# EAGLE design CO2SN (EAGLE 9.5.0)
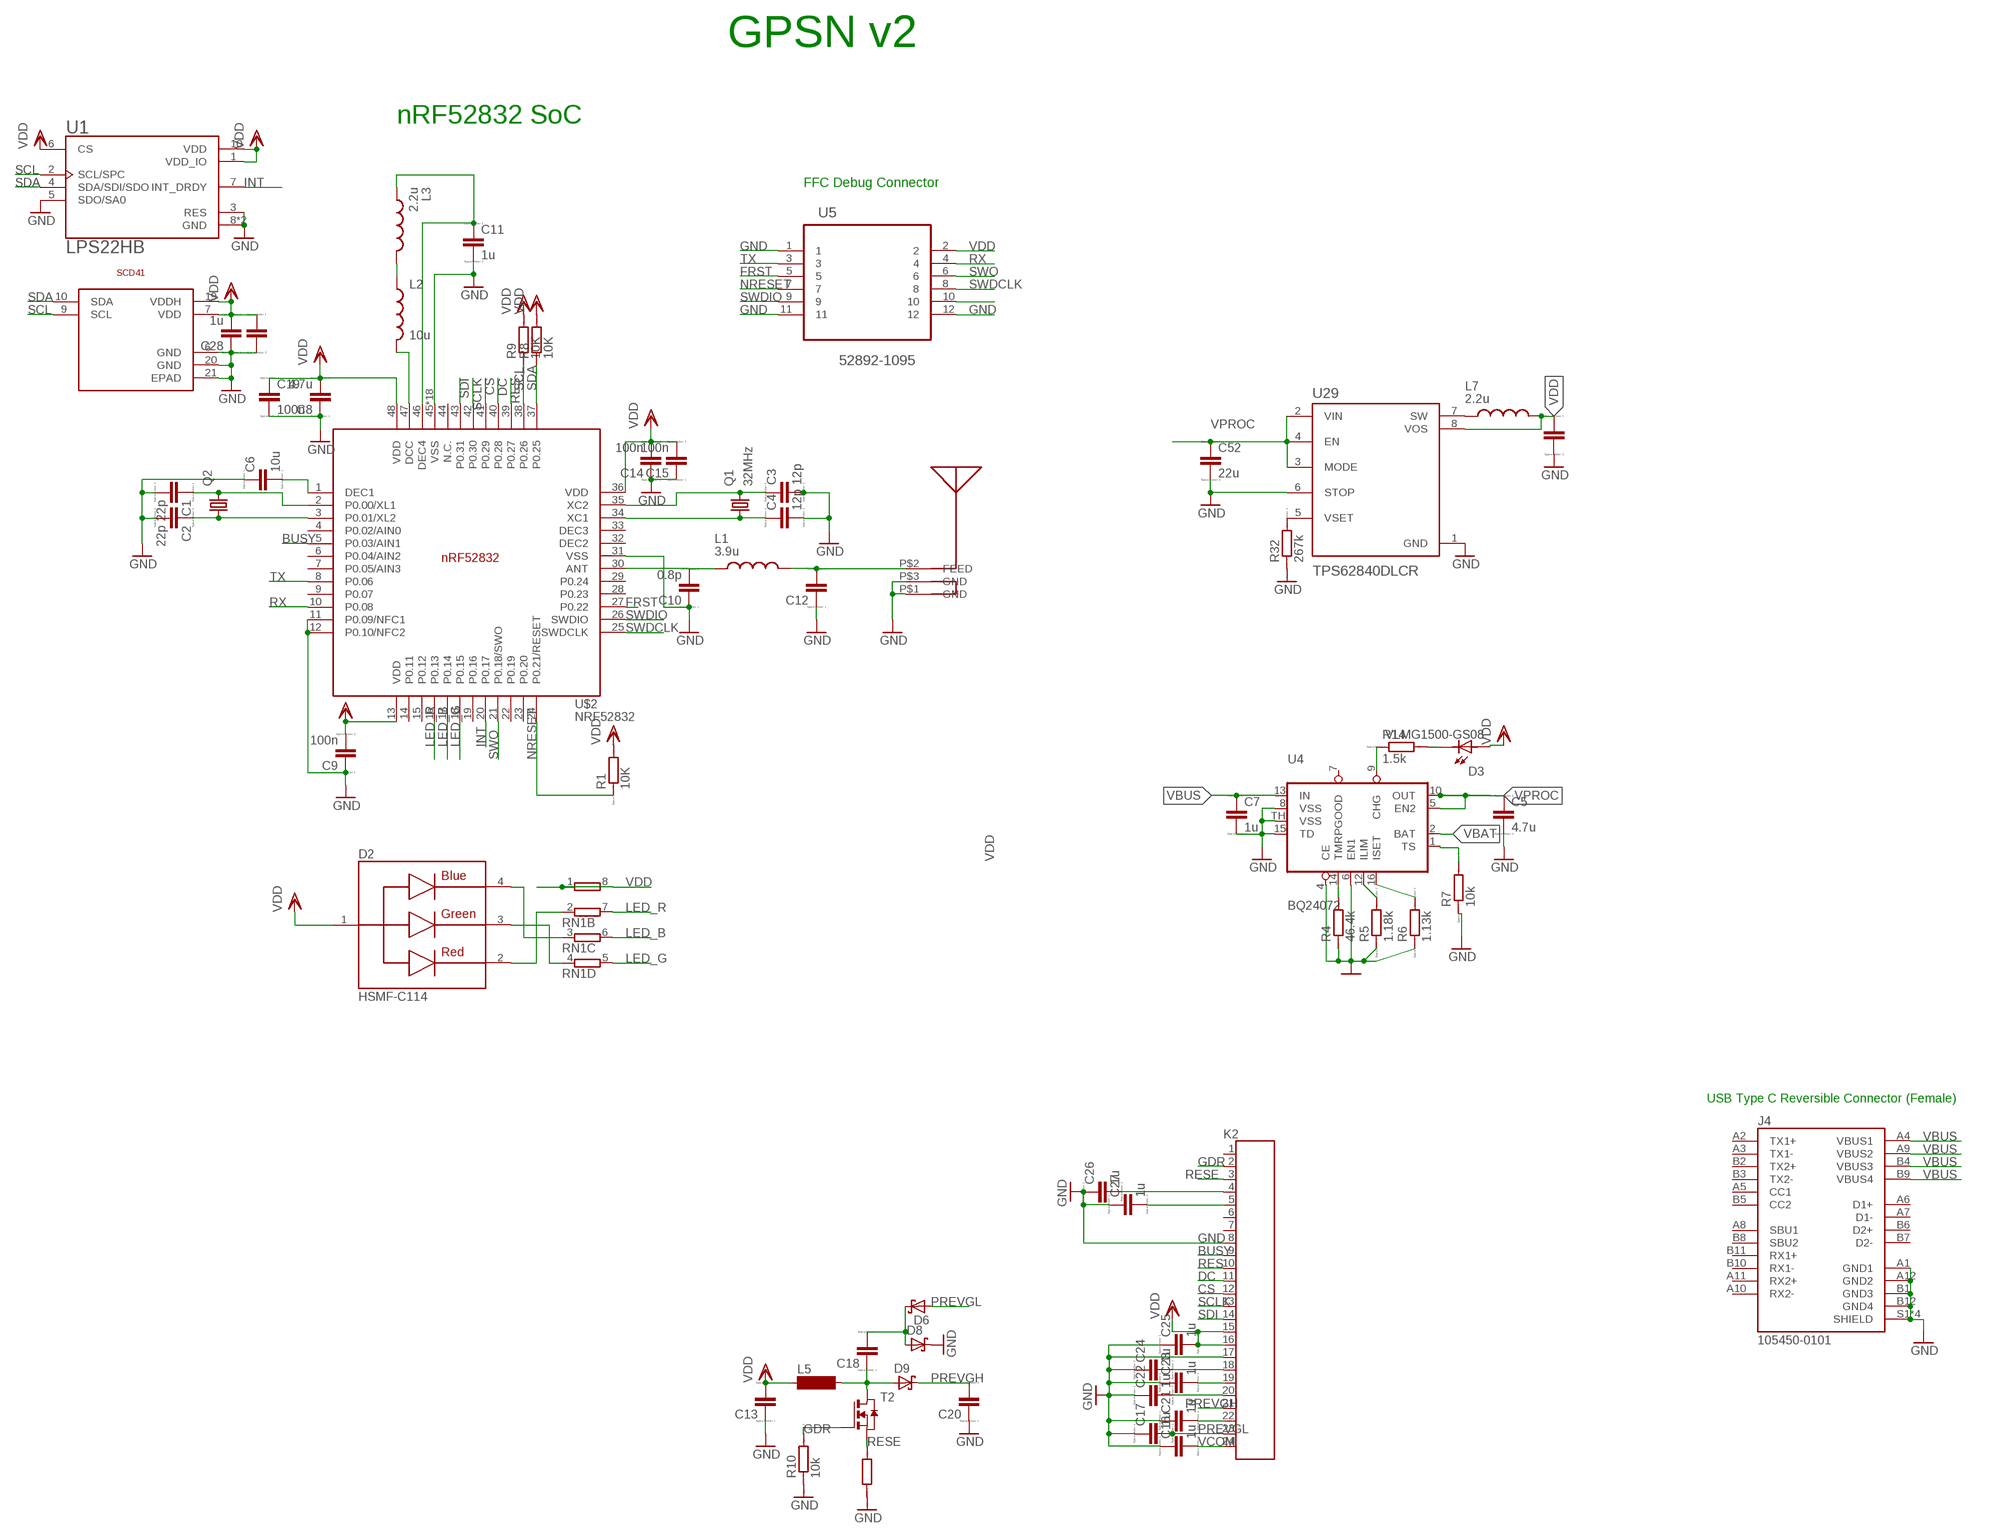
[diagram p0: schematic, sheet 1]

## Parts
C1  22p  CC0402  [C0402]
C2  22p  CC0402  [C0402]
C3  12p  CC0402  [C0402]
C4  12p  CC0402  [C0402]
C5  4.7u  CC0402  [C0402]
C6  10u  CC0402  [C0402]
C7  1u  CC0402  [C0402]
C8  4.7u  CC0402  [C0402]
C9  100n  CC0603R  [C0603R]
C10  0.8p  CC0402  [C0402]
C11  1u  CC0402  [C0402]
C12  1.2p  CC0402  [C0402]
C13  100n  CC0603R  [C0603R]
C14  100n  CC0402  [C0402]
C15  100n  CC0402  [C0402]
C16  1u  CC0402  [C0402]
C17  1u  CC0402  [C0402]
C18  100n  CC0603R  [C0603R]
C19  100n  CC0402  [C0402]
C20  100n  CC0603R  [C0603R]
C21  1u  CC0402  [C0402]
C22  1u  CC0402  [C0402]
C23  1u  CC0402  [C0402]
C24  1u  CC0402  [C0402]
C25  1u  CC0402  [C0402]
C26  1u  CC0402  [C0402]
C27  1u  CC0402  [C0402]
C28  1u  CC0402  [C0402]
C29  22u  CC0603R  [C0603R]
C52  22u  CC0603R  [C0603R]
C58  22u  CC0603R  [C0603R]
D2  HSMF-C114  [DIOSC160X150X35-4N]
D3  VLMG1500-GS08  [LEDC1005X35N]
D6  1PS79SB30,115  [SOD523]
D8  1PS79SB30,115  [SOD523]
D9  1PS79SB30,115  [SOD523]
J4  105450-0101  [MOLEX_105450-0101]
K2  687124149022  [687124149022]
L1  3.9u  MHQ0402P7N5JT000  [INDC0402X26N]
L2  10u  INDUCTOR  [L0603]
L3  2.2u  MHQ0402P7N5JT000  [INDC0402X26N]
L5  SM-NE29  [SM-NE29]
L7  2.2u  1277AS-H-1R5M=P2  [INDC3225X120N]
Q1  32MHz  KX-5  [2.0X1.6_KX-5]
Q2  KX-327-RT  [2.0X1.2]
R1  10K  RR0402  [R0402]
R4  46.4k  RR0402  [R0402]
R5  1.18k  RR0402  [R0402]
R6  1.13k  RR0402  [R0402]
R7  10k  RR0402  [R0402]
R8  10K  RR0402  [R0402]
R9  10K  RR0402  [R0402]
R10  10k  RR0402  [R0402]
R11  0.47  RR0402  [R0402]
R14  1.5k  RR0402  [R0402]
R32  267k  RR0402  [R0402]
RN1  4R-N0402ARV341  [4X0402ARV341]
T2  NMOSSOT23  [SOT-23]
U1  LPS22HB  [LGA10R50P2X3_200X200X80]
U4  BQ24072  [S-PVQFN-N16]
U5  52892-1095  [MOLEX_52892-1095]
U29  TPS62840DLCR  [SON50P200X150X100-8N]
U$1  SCD41  [SCD41]
U$2  NRF52832  [QFN40P600X600X90-48_N]
U$4  CHIPANTENNAL2  [CHIPANTENNAL2]

## Nets
BUSY: K2.9 U$2.5(P0.03/AIN1)
CS: K2.12 U$2.41(P0.29)
DC: K2.11 U$2.40(P0.28)
FRST: U5.5 U$2.27(P0.22)
GDR: K2.2 R10.2 T2.3(G)
GND: C1.2 C2.2 C3.2 C4.2 C5.2 C6.1 C7.2 C8.1 C9.1 C10.1 C11.2 C12.1 C13.1 C14.1 C15.1 C16.1 C17.1 C19.2 C20.1 C21.1 C22.1 C23.1 C24.1 C25.1 C26.1 C27.1 C28.1 C29.2 C52.2 C58.2 D8.1(K) J4.A1(GND1) J4.A12(GND2) J4.B1(GND3) J4.B12(GND4) J4.S1(SHIELD) J4.S2(SHIELD) J4.S3(SHIELD) J4.S4(SHIELD) K2.8 K2.17 R4.1 R5.1 R6.1 R7.1 R10.1 R11.1 R32.1 U1.3(RES) U1.5(SDO/SA0) U1.8(GND) U1.9(GND) U4.4(CE) U4.6(EN1) U4.8(VSS) U4.15(TD) U4.TH(VSS) U5.1 U5.11 U5.12 U29.1(GND) U29.6(STOP) U$1.6(GND) U$1.20(GND) U$1.21(EPAD) U$2.11(P0.09/NFC1) U$2.12(P0.10/NFC2) U$2.31(VSS) U$2.45(VSS) U$2.PAD(VSS) U$2.PAD@VIA01(VSS) U$2.PAD@VIA02(VSS) U$2.PAD@VIA03(VSS) U$2.PAD@VIA04(VSS) U$2.PAD@VIA05(VSS) U$2.PAD@VIA06(VSS) U$2.PAD@VIA07(VSS) U$2.PAD@VIA08(VSS) U$2.PAD@VIA09(VSS) U$2.PAD@VIA10(VSS) U$2.PAD@VIA11(VSS) U$2.PAD@VIA12(VSS) U$2.PAD@VIA13(VSS) U$2.PAD@VIA14(VSS) U$2.PAD@VIA15(VSS) U$2.PAD@VIA16(VSS) U$4.P$1(GND) U$4.P$3(GND)
INT: U1.7(INT_DRDY) U$2.20(P0.17)
LED_B: RN1.6 U$2.17(P0.14)
LED_G: RN1.5 U$2.18(P0.15)
LED_R: RN1.7 U$2.16(P0.13)
N$1: C1.1 Q2.2 U$2.2(P0.00/XL1)
N$2: C2.1 Q2.1 U$2.3(P0.01/XL2)
N$3: C3.1 Q1.3 U$2.35(XC2)
N$4: C4.1 Q1.1 U$2.34(XC1)
N$5: L2.2 U$2.47(DCC)
N$6: C10.2 L1.1 U$2.30(ANT)
N$7: C6.2 U$2.1(DEC1)
N$8: R4.2 U4.14(TMR)
N$9: R5.2 U4.12(ILIM)
N$10: L2.1 L3.2
N$11: C11.1 L3.1 U$2.46(DEC4)
N$12: R6.2 U4.16(ISET)
N$13: U5.10
N$14: D2.2 RN1.2
N$15: D3.2 R14.2
N$16: R14.1 U4.9(CHG)
N$17: C18.1 D9.2(A) L5.2 T2.1(D)
N$18: C18.2 D6.1(K) D8.2(A)
N$20: D2.3 RN1.4
N$21: D2.4 RN1.3
N$26: C21.2 K2.22
N$27: C22.2 K2.20
N$28: C23.2 K2.19
N$29: C24.2 K2.18
N$36: C27.2 K2.5
N$37: C26.2 K2.4
N$80: L7.1 U29.7(SW)
N$94: R32.2 U29.5(VSET)
NRESET: R1.1 U5.7 U$2.24(P0.21/RESET)
PREVGH: C20.2 D9.1(K) K2.21
PREVGL: C17.2 D6.2(A) K2.23
RES: K2.10 U$2.39(P0.27)
RESE: K2.3 R11.2 T2.2(S)
RF: C12.2 L1.2 U$4.P$2(FEED)
RX: U5.4 U$2.10(P0.08)
SCL: R9.1 U1.2(SCL/SPC) U$1.9(SCL) U$2.38(P0.26)
SCLK: K2.13 U$2.42(P0.30)
SDA: R8.1 U1.4(SDA/SDI/SDO) U$1.10(SDA) U$2.37(P0.25)
SDI: K2.14 U$2.43(P0.31)
SWDCLK: U5.8 U$2.25(SWDCLK)
SWDIO: U5.9 U$2.26(SWDIO)
SWO: U5.6 U$2.21(P0.18/SWO)
TS: R7.2 U4.1(TS)
TX: U5.3 U$2.8(P0.06)
VBAT [PWRINFL]: U4.2(BAT)
VBUS: C7.1 J4.A4(VBUS1) J4.A9(VBUS2) J4.B4(VBUS3) J4.B9(VBUS4) U4.13(IN)
VCOM: C16.2 K2.24
VDD: C8.2 C9.2 C13.2 C14.2 C15.2 C19.1 C25.2 C28.2 C29.1 C58.1 D2.1 D3.1 K2.15 K2.16 L5.1 L7.2 R1.2 R8.2 R9.2 RN1.1 RN1.8 U1.1(VDD_IO) U1.6(CS) U1.10(VDD) U5.2 U29.8(VOS) U$1.7(VDD) U$1.19(VDDH) U$2.13(VDD) U$2.36(VDD) U$2.48(VDD)
VPROC [NCLS3V7]: C5.1 C52.1 U4.5(EN2) U4.10(OUT) U29.2(VIN) U29.3(MODE) U29.4(EN)
Unconnected: J4.A2(TX1+) J4.A3(TX1-) J4.A5(CC1) J4.A6(D1+) J4.A7(D1-) J4.A8(SBU1) J4.A10(RX2-) J4.A11(RX2+) J4.B2(TX2+) J4.B3(TX2-) J4.B5(CC2) J4.B6(D2+) J4.B7(D2-) J4.B8(SBU2) J4.B10(RX1-) J4.B11(RX1+) K2.1 K2.6 K2.7 U4.7(PGOOD) U$2.4(P0.02/AIN0) U$2.6(P0.04/AIN2) U$2.7(P0.05/AIN3) U$2.9(P0.07) U$2.14(P0.11) U$2.15(P0.12) U$2.19(P0.16) U$2.22(P0.19) U$2.23(P0.20) U$2.28(P0.23) U$2.29(P0.24) U$2.32(DEC2) U$2.33(DEC3) U$2.44(N.C.)

## Notes on the sheet
- GPSN v2
- nRF52832 SoC
- FFC Debug Connector
- USB Type C Reversible Connector (Female)

## Library data of the parts
C1-C8 C10-C12 C14-C17 C19 C21-C28 = eagle-ltspice:C: CAPACITOR, European symbol; SPICEMODEL: NONE; SPICEPREFIX: C
C9 C13 C18 C20 C29 C52 C58 = eagle-ltspice:C: CAPACITOR, European symbol
D2 = HSMF-C114:HSMF-C114: LED Tri-Color Blue/Green/Red 468nm/523nm/637nm 4-Pin Chip LED T/R; AVAILABILITY: Unavailable; DESCRIPTION: LED RGB DIFFUSED CHIP SMD; MF: Broadcom Limited; MP: HSMF-C114; PACKAGE: 0606 Broadcom; PRICE: None
D3 = VLMG1500-GS08:VLMG1500-GS08: 0402 GREEN 571nm 35MCD 65° Rectangle with Flat Top SMT LED; AVAILABILITY: Unavailable; DESCRIPTION: 0402 GREEN 571nm 35MCD 65° Rectangle with Flat Top SMT LED; MF: Vishay; MP: VLMG1500-GS08; PACKAGE: 0402 Vishay; PRICE: None
D6 D8 D9 = 1PS79SB30_115:1PS79SB30,115: 4 V, 30 mA low Cd Schottky barrier diode Planar low capacitance Schottky barrier diode encapsulated in a very small SMD plastic package. AAL Eindhoven MK; AVAILABILITY: Unavailable; DESCRIPTION: 1PS79SB30 Series 40 V 200 mA Surface Mount Schottky Barrier Diode - SOD-523; MF: Nexperia; MP: 1PS79SB30,115; PACKAGE: SOD-523 Nexperia; PRICE: None
J4 = 105450-0101:105450-0101: USB Shielded I/O Receptacle; Type C; Right Angle; Surface Mount; Gold over Nickel; AVAILABILITY: Unavailable; DESCRIPTION: USB-C (USB TYPE-C) USB 3.1 (USB 3.1 Gen 2, Superspeed+) Receptacle Connector 24 Position Surface Mount, Right Angle; Through Hole; MF: Molex; MP: 1054500101; PACKAGE: None; PRICE: None
K2 = 687124149022:687124149022: WR-FPC 0.50mm SMT Horiz. Bot. Contact Hinge type WR-FPC 0.50mm 24 pins Hinge type SMT Horizontal Bottom Contact ;=>Code : Con_FPC_ZIF_0.50_6871xx149022_687124149022 Details see: http://katalog.we-online.de/em/datasheet/6871xx149022.pdf Created 2014-10-08, Karrer Zheng 2014 (C) Wurth Elektronik; AVAILABILITY: Unavailable; DESCRIPTION: FFC / FPC Board Connector, WR-FPC Series, Surface Mount, Receptacle, 24, Bottom, 0.5 mm; MF: Wurth Electronics; MP: 687124149022; PACKAGE: None; PRICE: None
L1 L3 = MHQ0402P7N5JT000:MHQ0402P7N5JT000: 221 NH 5% GOLD TERMINAL; AVAILABILITY: Unavailable; DESCRIPTION: FIXED IND 7.5NH 200MA 1.2 OHM; MF: TDK; MP: MHQ0402P7N5JT000; PACKAGE: 0402 TDK; PRICE: None
L2 = BeagleBone_Blue_R3:INDUCTOR: Inductors Basic Inductor/Choke - 0603 and 1206. Footprints are not proven and vary greatly between part numbers. SRN6045- 33uH, 20% 1.4A
L5 = inductor-neosid:SM-NE29: INDUCTOR SMD chip inductor; OC_FARNELL: unknown; OC_NEWARK: unknown
L7 = 1277AS-H-1R5M_P2:1277AS-H-1R5M=P2: Ind Metal Alloy Shielded 1.5uH 20% 1MHz Powdered Iron 2.6A 1210 T/R Check prices; AVAILABILITY: Warning; DESCRIPTION: Inductor with Inductance: 1.5uH Tol. +/-20%, Package: 1210 (3225); MF: Murata; MP: 1277AS-H-1R5M=P2; PACKAGE: 1210 Murata; PRICE: None; PURCHASE-URL: https://pricing.snapeda.com/search/part/1277AS-H-1R5M=P2/?ref=eda
Q1 = crystal-geyer_V1_0:KX: Quartz Crystals (MHz) SMD: KX - Serie Model Size l/w/h [mm] Frequency Range Frequency Stability Temp. Range [°C] Load Capacitance AECQ 200 availabel Datasheet KX-4 KX-5 KX-6 KX-7 KX-9A KX-9B KX-12A KX-12B KX-13 KX-20 KX-K KX-KS 1.6/1.2/0.3 2.0/1.6/0.45 2.5/2.0/0.55 3.2/2.5/0.8 5.0/3.2/1.0 5.0/3.2/1.1 6.0/3.5/1.1 6.0/3.5/1.0 7.0/5.0 /1.3 11.6/5.5/1.6 12.3/4.5/4.2 12.3/4.5/3.2 24.0 ~ 80.0 MHz 16.0 ~ 80.0 MHz 12.0 ~ 80.0 MHz 8.0 ~ 60.0 MHz 7,68 ~ 300,0 MHz 8,0 ~ 50,0 MHz 8,0 ~ 150,0 MHz 8,0 ~ 50,0 MHz 6,0 ~ 160,0 MHz 3,579 ~ 25,0 MHz 3,579 ~ 70,0 MHz 3,579 ~ 70,0 MHz ±10 … ±50ppm ±10 … ±50ppm ±10 … ±50ppm ±10 … ±50ppm ±10 … ±50ppm ±10 … ±50ppm ±10 … ±50ppm ±10 … ±50ppm ±10 … ±50ppm ±50ppm ±10 … ±50ppm ±10 … ±50ppm (*) -40°C …+85°C (*) -40°C …+125°C (*) -40°C …+125°C (*) -40°C …+125°C (*) -40°C …+105°C (*) -40°C …+105°C (*) -40°C …+125°C (*) -40°C …+105°C (*) -40°C …+105°C (*) -40°C …+105°C (*) -40°C …+85°C (*) -40°C …+85°C 8, 8…16 8, 8…16 10, 8…16 12, 7…20 16, 10…20 16, 10…20 16, 10…20 16, 12…20 16, 12…20 16, 12…20 16, 12…30 16, 12…30 - yes yes yes - - - - - - - - KX-4.pdf KX-5.pdf KX-6.pdf KX-7.pdf KX-9A.pdf KX-9B.pdf KX-12A.pdf KX-12B.pdf KX-13.pdf KX-20.pdf KX-K.pdf KX-KS.pdf Details see: http://www.geyer-electronic.de/Frequenz-Produkte.9.0.html Created 2016-06-07, Hans Locher 2016 (C) Geyer Quartz Technology KX4,KX5,KX6,KX7,KX9A,KX9B,KX12A,KX12B,KX13,KX20,KXK,KXKS;1612;2016;2520;3225;5032;6035;7050;11655;12345;1,6x1,2;2,0x1,6;2,5x2,0;3,2x2,5;5,0x3,2;6,0x3,5;7,0x5,0;11,6x5,5;12,3x4,5;12,3x4,5;1.6x1.2;2.0x1.6;2.5x2.0;3.2x2.5;5.0x3.2;6.0x3.5;7.0x5.0;11.6x5.5;12.3x4.5;12.3x4.5;
Q2 = crystal-geyer_V1_0:KX-327: Tuning Fork Crystals (kHz) SMD: KX327 - Serie Model Size l/w/h [mm] Frequency Range Frequency Stability Temp. Range [°C] Load Capacitance AECQ 200 availabel Datasheet KX-327VT KX-327FT KX-327RT KX-327NHT KX-327NHF KX-327L KX-327S 1.25/1.05/0.5 1.6/1.0/0.5 2.0/1.2/0.6 3.2/1.5/0.8 3.2/1.5/0.8 7.0/1.5/1.4 8.2/3.8/2.5 32,768 kHz 32,768 kHz 32,768 kHz 32,768 kHz 32,768 kHz 32,768 kHz 32,768 kHz ±10 … ±20ppm ±10 … ±20ppm ±10 … ±20ppm ±10 … ±20ppm ±10 … ±20ppm ±10 … ±20ppm ±5 … ±20ppm (*) -40°C …+85°C (*) -40°C …+85°C (*) -40°C …+85°C (*) -40°C …+85°C (*) -40°C …+125°C (*) -40°C …+85°C (*) -40°C …+85°C 7/9/12,5 7/9/12,5 7/9/12,6 7/9/12,5 9/12,5 7/9/12,5 6/12,5 - - - - yes - - KX-327VT.pdf KX-327FT.pdf KX-327RT.pdf KX-327NHT.pdf KX-327NHF.pdf KX-327L.pdf KX-327S.pdf Details see: http://www.geyer-electronic.de/Frequenz-Produkte.9.0.html Created 2016-06-07, Hans Locher 2016 (C) Geyer Quartz Technology KX327VT,KX327FT,KX327RT,KX327NHT,KX327NHF,KX327S,KX327L;125105;1610;2012;3215;7015;8238;1,25x1,05,1.25x1.05;1,6x1,0,1.6x1.0;2,0x1,2,2.0x1.2;3,2x1,5,3.2x1.5;8,2x3,8,8.2x3.8,7.0x1.5,7,0x1,532.768kHz
R1 R4-R11 R14 R32 = eagle-ltspice:R: RESISTOR, European symbol; SPICEMODEL: NONE; SPICEPREFIX: R
RN1 = resistor-dil:4R-N: Array Chip Resistor Source: RS Component / Phycomp; OC_FARNELL: unknown; OC_NEWARK: unknown
T2 = zetex:NMOSSOT23: MOS FET; OC_FARNELL: unknown; OC_NEWARK: unknown
U1 = LPS22HB:LPS22HB: MEMS nano pressure sensor: 260-1260 hPa absolute digital output barometer Check prices; AVAILABILITY: No availability data; DESCRIPTION: Pressure Sensor 3.77PSI ~ 18.27PSI (26kPa ~ 126kPa) Absolute 24 b 10-WFLGA Exposed Pad; MF: STMicroelectronics; MP: LPS22HB; PACKAGE: WFLGA-10 STMicroelectronics; PRICE: None
U4 = Simplex-ICs:BQ24072: TI BQ24072 - Li battery charger and power path management ic
U5 = 52892-1095:52892-1095: CONNECTOR, FPC, ZIF, 0.50MM, 10 WAY; AVAILABILITY: Unavailable; DESCRIPTION: Socket, r/a, Fpc, Zif, Smt, 10way; MF: Molex; MP: 52892-1095; PACKAGE: None; PRICE: None
U29 = TPS62840DLCR:TPS62840DLCR: None Check prices Check prices; AVAILABILITY: Warning; DESCRIPTION: 60-nA IQ, 1.8-V to 6.5-VIN, high-efficiency 750-mA step-down converter 8-VSON-HR -40 to 125; MF: Texas Instruments; MP: TPS62840DLCR; PACKAGE: VSON-HR-8 Texas Instruments; PRICE: None; PURCHASE-URL: https://pricing.snapeda.com/search/part/TPS62840DLCR/?ref=eda
U$1 = SCD41:SCD41
U$2 = Nordic_nRF:NRF52832: nRF52832 Features Single chip, highly flexible, 2.4 GHz multi-protocol SoC 32-bit ARM Cortex-M4F Processor 1.7v to 3.6v operation 512kB flash + 64kB RAM Supports concurrent Bluetooth Smart/ANT protocol operation On-chip NFC tag for Out-of-Band (OOB) pairing Up to +4dBm output power -96dBm sensitivity, Bluetooth Smart Thread safe and run-time protected Event driven API On air compatible with nRF24L and nRF24AP series 2 data rates (2Mbps/1Mbps) PPI - maximum flexibility for power-efficient applications and code simplification Automated power management system with automatic power management of each peripheral Configurable I/O mapping for analog and digital I/O 3 x Master/Slave SPI 2 x Two-wire interface (I²C) UART (RTS/CTS) 3 x PWM AES HW encryption Real Time Counter (RTC) Digital microphone interface (PDM) On-chip balun Applications Internet of Things (IoT) Wearables SmartHome sensors Connected white goods Computer peripherals Voice-command smart remotes A4WP ‘Rezence’ wireless charging Beacons Sports and fitness sensors and hubs Connected health products Smart watches RC Toys Interactive games Building automation and sensor networks
U$4 = CHIPANTENNA:CHIPANTENNAL2

## Net classes
1 PWRINFL: width 0.381 mm, drill 0.305 mm, clearance 0.127 mm
2 NCLS3V7: width 0.178 mm, drill 0.178 mm, clearance 0.178 mm

## Board
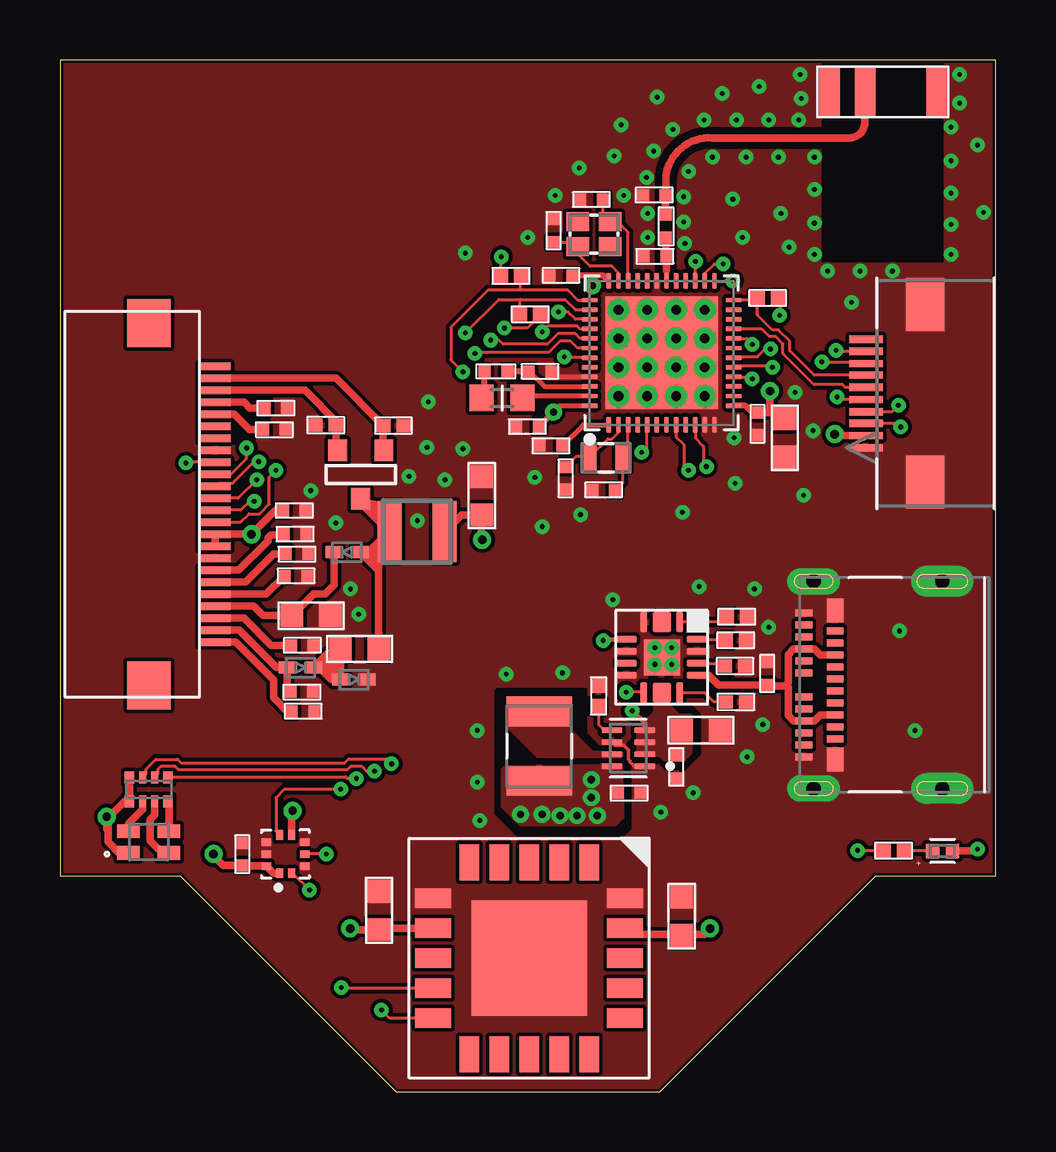
[diagram p1: board, top side]
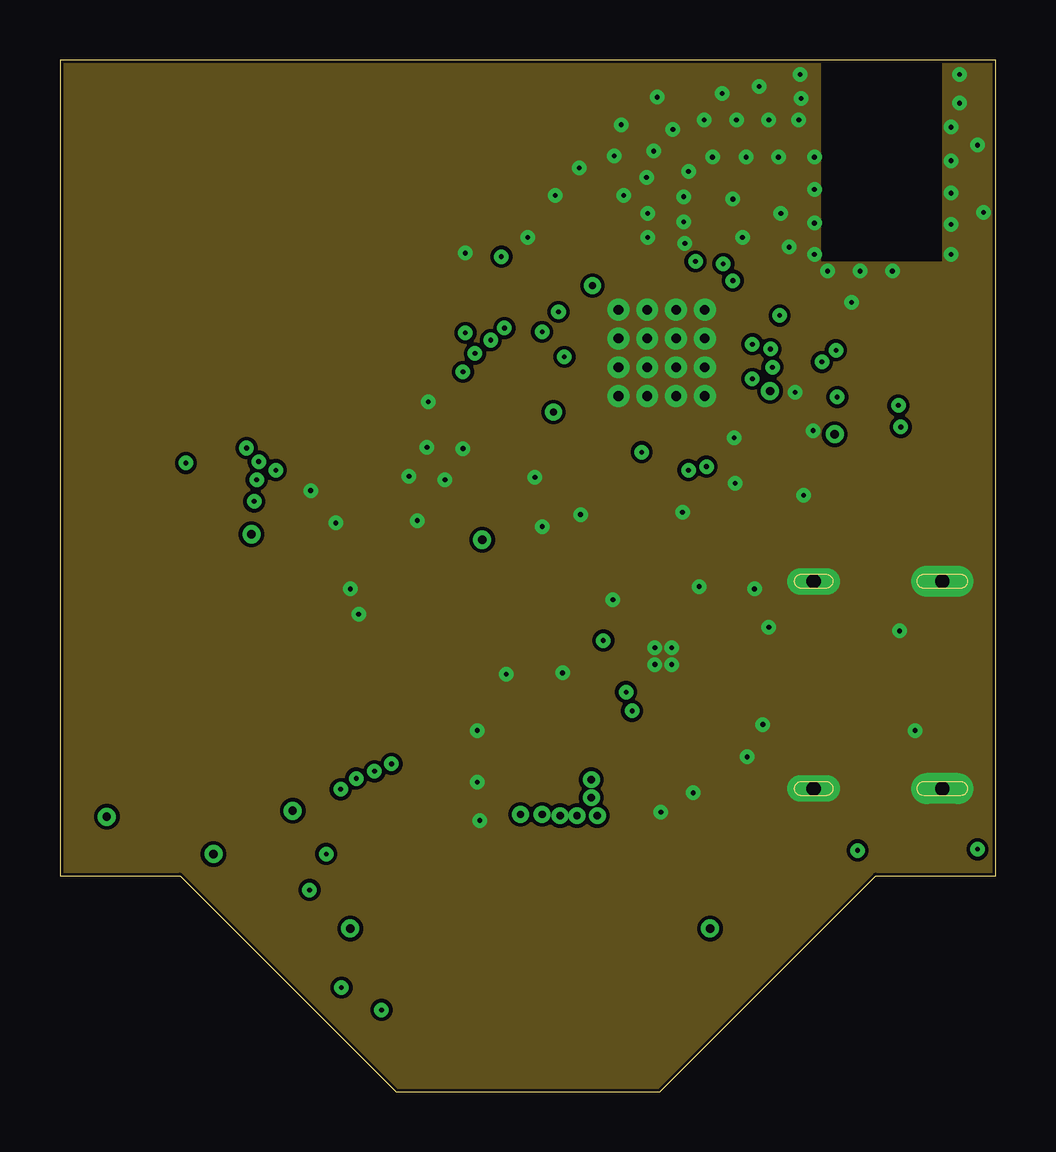
[diagram p2: board, inner layer Route2]
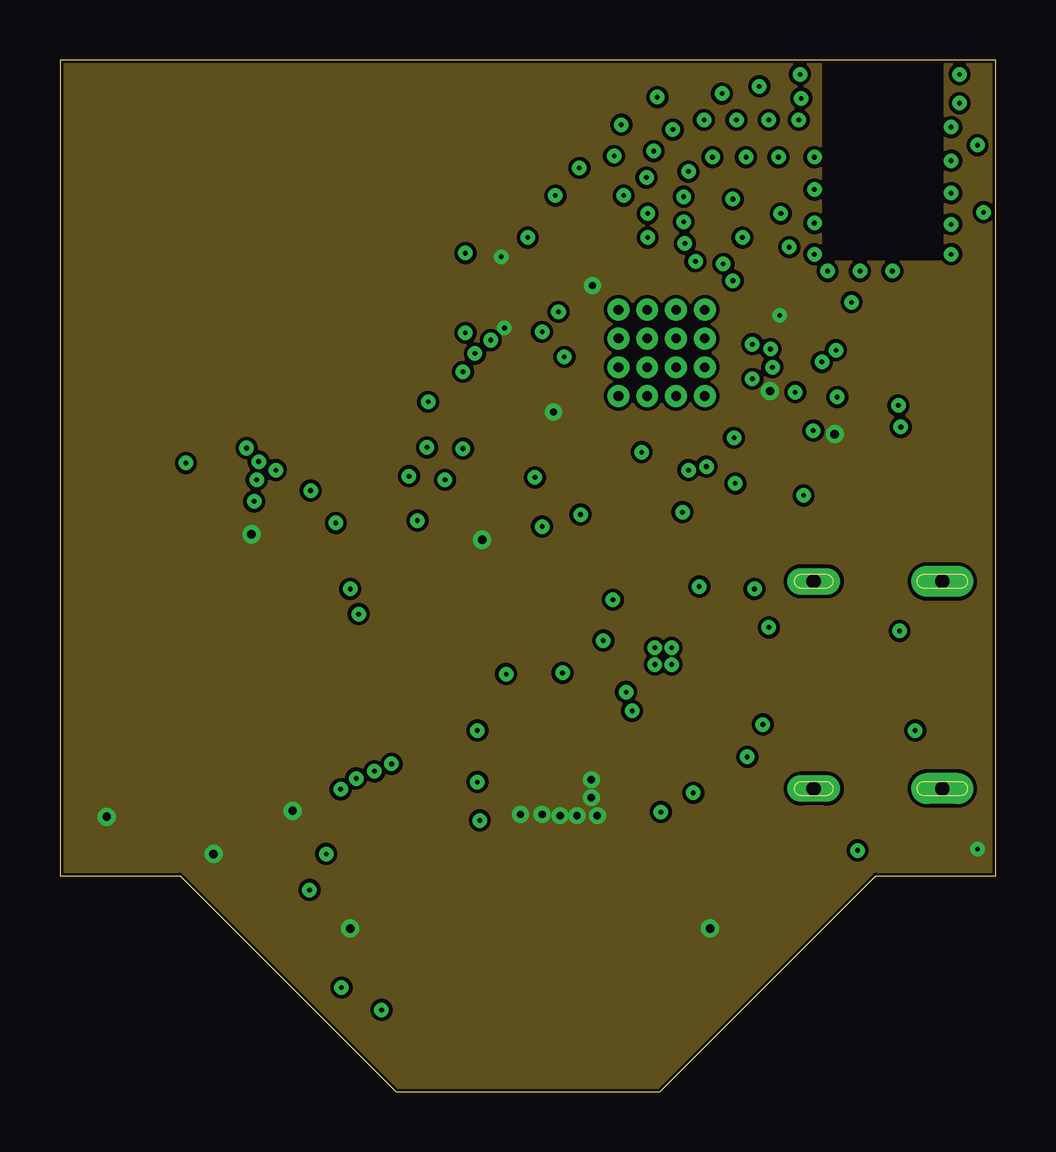
[diagram p3: board, inner layer Route15]
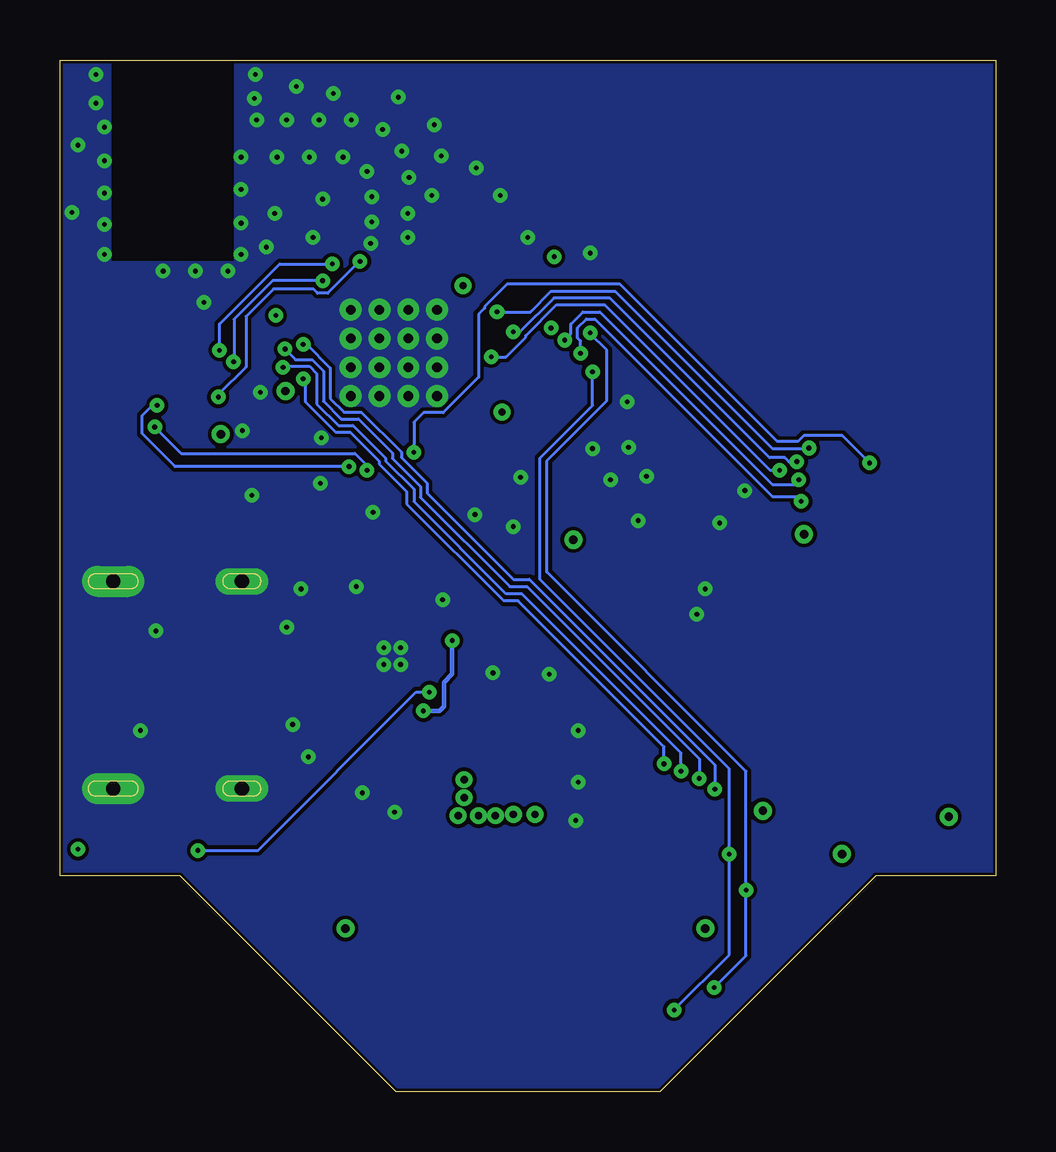
[diagram p4: board, bottom side, seen from below]

Size 39 x 43 mm. Coordinates in mm from the lower left corner, seen from the top.
Outline: 0,9 5,9 14,0 25,0 34,9 39,9 39,43 0,43 0,9
Copper layers (1+2*15+16): Top 0.035mm / dielectric 1.5mm / Route2 0.035mm / dielectric 0.15mm / Route15 0.035mm / dielectric 0.2mm / Bottom 0.035mm
Design rules "default *": minimum track width 5mil, minimum drill 0.2mm, track to track 6mil, track to pad 6mil, pad to pad 6mil, via to via 6mil, smd to smd 6mil, copper to edge 5mil, drill to drill 6mil, minimum pad ring 10mil, minimum via ring 8mil, stop-mask expansion 0mil, vias tented up to drill 40mil, thermal gap 0mil
tRestrict: 8 lines

### Footprints (pad centres in the part's own frame; a part is rotated, then mirrored left to right if it is on the bottom)
C0402 = smd 0.5 x 0.5: 1 -0.475,0; 2 0.475,0
C0603R = smd 0.95 x 0.95: 1 -0.85,0; 2 0.75,0
DIOSC160X150X35-4N = smd 0.94 x 0.57: 1 -0.845,-0.45; 2 -0.845,0.45; 3 0.845,0.45; 4 0.845,-0.45
LEDC1005X35N = smd 0.59 x 0.61: 1 -0.415,0; 2 0.415,0
SOD523 = smd 0.7 x 0.5: 1 0.55,0; 2 -0.55,0
MOLEX_105450-0101 = smd 0.3 x 0.7: A1 -3,3.77; A2 -2.5,3.77; A3 -2,3.77; A4 -1.5,3.77; A5 -1,3.77; A6 -0.5,3.77; A7 0.5,3.77; A8 1,3.77; A9 1.5,3.77; A10 2,3.77; A11 2.5,3.77; A12 3,3.77; B2 2.25,2.47; B3 1.75,2.47; B4 1.25,2.47; B5 0.75,2.47; B6 0.25,2.47; B7 -0.25,2.47; B8 -0.75,2.47; B9 -1.25,2.47; B10 -1.75,2.47; B11 -2.25,2.47 | smd 1 x 0.7: B1 3.1,2.47; B12 -3.1,2.47 | drill 0.6 pad 1.1 long: S1 -4.32,3.36; S2 4.32,3.36 | drill 0.6 pad 1.3 long: S3 -4.32,-2; S4 4.32,-2
687124149022 = smd 0.3 x 1.3: 1 -5.75,0; 2 -5.25,0; 3 -4.75,0; 4 -4.25,0; 5 -3.75,0; 6 -3.25,0; 7 -2.75,0; 8 -2.25,0; 9 -1.75,0; 10 -1.25,0; 11 -0.75,0; 12 -0.25,0; 13 0.25,0; 14 0.75,0; 15 1.25,0; 16 1.75,0; 17 2.25,0; 18 2.75,0; 19 3.25,0; 20 3.75,0; 21 4.25,0; 22 4.75,0; 23 5.25,0; 24 5.75,0 | smd 2 x 1.8: Z1 -7.55,-2.75; Z2 7.55,-2.75
INDC0402X26N = smd 0.5 x 0.5: 1 -0.732,0; 2 0.232,0
L0603 = smd 1 x 1.1: 1 -0.85,0; 2 0.85,0
SM-NE29 = smd 1 x 2.54: 1 -1.15,0; 2 1.15,0
INDC3225X120N = smd 1.24 x 2.72: 1 -1.44,0; 2 1.44,0
2.0X1.6_KX-5 = smd 0.95 x 0.8: 1 -0.675,-0.525; 2 0.675,-0.525; 3 0.675,0.525; 4 -0.675,0.525
2.0X1.2 = smd 0.6 x 1.1: 1 -0.7,0; 2 0.7,0
R0402 = smd 0.6 x 0.55: 1 -0.425,0; 2 0.425,0
4X0402ARV341 = smd 0.4 x 0.5: 1 -0.8,-0.5; 4 0.8,-0.5; 5 0.8,0.5; 8 -0.8,0.5 | smd 0.3 x 0.5: 2 -0.25,-0.5; 3 0.25,-0.5; 6 0.25,0.5; 7 -0.25,0.5
SOT-23 = smd 0.787 x 0.889: 1 0.025,-1.016; 2 -0.94,1.016; 3 0.991,1.016
LGA10R50P2X3_200X200X80 = smd 0.4 x 0.3: 1 -0.8,0.25; 2 -0.8,-0.25; 6 0.8,-0.25; 7 0.8,0.25 | smd 0.3 x 0.4: 3 -0.5,-0.8; 4 0,-0.8; 5 0.5,-0.8; 8 0.5,0.8; 9 0,0.8; 10 -0.5,0.8
S-PVQFN-N16 = smd 0.85 x 0.28: 1 -0.725,2.225; 4 -0.725,0.725; 9 2.225,0.725; 12 2.225,2.225 | smd 0.85 x 0.78: 2 -0.725,1.475; 10 2.225,1.475 | smd 0.28 x 0.85: 5 0,0; 6 0.5,0; 7 1,0; 8 1.5,0; 13 1.5,2.95; 14 1,2.95; 15 0.5,2.95; 16 0,2.95 | smd 1.5 x 1.5: TH 0.75,1.475
MOLEX_52892-1095 = smd 0.305 x 1.397: 1 2.261,2.896; 2 1.753,2.896; 3 1.245,2.896; 4 0.762,2.896; 5 0.254,2.896; 6 -0.254,2.896; 7 -0.762,2.896; 8 -1.245,2.896; 9 -1.753,2.896; 10 -2.261,2.896 | smd 2.21 x 1.6: 11 -3.702,5.359; 12 3.702,5.359
SON50P200X150X100-8N = smd 0.86 x 0.27: 1 -0.685,0.75; 2 -0.685,0.25; 3 -0.685,-0.25; 4 -0.685,-0.75; 5 0.685,-0.75; 6 0.685,-0.25; 7 0.685,0.25; 8 0.685,0.75
SCD41 = smd 1.5 x 0.8: 1 0,0; 2 0,-1.25; 3 0,-2.5; 4 0,-3.75; 5 0,-5; 11 8,-5; 12 8,-3.75; 13 8,-2.5; 14 8,-1.25; 15 8,0 | smd 0.8 x 1.5: 6 1.5,-6.5; 7 2.75,-6.5; 8 4,-6.5; 9 5.25,-6.5; 10 6.5,-6.5; 16 6.5,1.5; 17 5.25,1.5; 18 4,1.5; 19 2.75,1.5; 20 1.5,1.5 | smd 4.8 x 4.8: 21 4,-2.5
QFN40P600X600X90-48_N = smd 0.65 x 0.2: 1 -3,2.2; 2 -3,1.8; 3 -3,1.4; 4 -3,1; 5 -3,0.6; 6 -3,0.2; 7 -3,-0.2; 8 -3,-0.6; 9 -3,-1; 10 -3,-1.4; 11 -3,-1.8; 12 -3,-2.2; 25 3,-2.2; 26 3,-1.8; 27 3,-1.4; 28 3,-1; 29 3,-0.6; 30 3,-0.2; 31 3,0.2; 32 3,0.6; 33 3,1; 34 3,1.4; 35 3,1.8; 36 3,2.2 | smd 0.2 x 0.65: 13 -2.2,-3; 14 -1.8,-3; 15 -1.4,-3; 16 -1,-3; 17 -0.6,-3; 18 -0.2,-3; 19 0.2,-3; 20 0.6,-3; 21 1,-3; 22 1.4,-3; 23 1.8,-3; 24 2.2,-3; 37 2.2,3; 38 1.8,3; 39 1.4,3; 40 1,3; 41 0.6,3; 42 0.2,3; 43 -0.2,3; 44 -0.6,3; 45 -1,3; 46 -1.4,3; 47 -1.8,3; 48 -2.2,3 | smd 4.7 x 4.7: PAD 0,0 | drill 0.4: PAD@VIA01 -1.8,1.8; PAD@VIA02 -1.8,0.6; PAD@VIA03 -1.8,-0.6; PAD@VIA04 -1.8,-1.8; PAD@VIA05 -0.6,1.8; PAD@VIA06 -0.6,0.6; PAD@VIA07 -0.6,-0.6; PAD@VIA08 -0.6,-1.8; PAD@VIA09 0.6,1.8; PAD@VIA10 0.6,0.6; PAD@VIA11 0.6,-0.6; PAD@VIA12 0.6,-1.8; PAD@VIA13 1.8,1.8; PAD@VIA14 1.8,0.6; PAD@VIA15 1.8,-0.6; PAD@VIA16 1.8,-1.8
CHIPANTENNAL2 = smd 0.85 x 2: P$1 0.45,1; P$2 1.925,1; P$3 4.9,1

### Placement (x,y rotation side)
C1  21.08,25.56 270 top
C2  22.67,25.08 180 top
C3  20.58,35.89 90 top
C4  22.15,37.18 180 top
C5  25.69,13.53 270 top
C6  20.47,26.92 0 top
C7  29.48,17.43 90 top
C8  20.89,34.02 0 top
C9  17.58,24.79 270 top
C10  24.8,34.82 0 top
C11  20.01,30.02 0 top
C12  24.77,37.37 0 top
C13  30.22,27.3 90 top
C14  29.08,27.83 90 top
C15  19.49,27.72 0 top
C16  10.14,15.85 180 top
C17  10.08,16.65 180 top
C18  12.44,18.45 180 top
C19  9.77,24.22 0 top
C20  10.42,19.84 180 top
C21  10.1,18.6 180 top
C22  9.84,21.5 180 top
C23  9.88,22.4 180 top
C24  9.8,23.24 180 top
C25  23.73,12.44 180 top
C26  9,28.49 180 top
C27  8.94,27.59 180 top
C28  7.6,9.9 270 top
C29  13.3,7.6 90 top
C52  26.77,15.06 0 top
C58  25.92,7.36 90 top
D2  3.7,10.4 0 top
D3  36.79,10.03 180 top
D6  10.02,17.67 0 top
D8  12.25,17.17 0 top
D9  11.97,22.48 180 top
J4  34.78,16.95 90 top
K2  6.46,24.48 270 top
L1  25.27,36.32 90 top
L2  18.43,28.91 0 top
L3  17.92,30.02 180 top
L5  14.88,23.34 180 top
L7  19.98,14.4 270 top
Q1  22.26,35.74 180 top
Q2  22.76,26.42 180 top
R1  29.5,33.08 0 top
R4  28.14,17.74 180 top
R5  28.18,16.24 180 top
R6  28.17,18.81 180 top
R7  28.21,19.79 180 top
R8  18.8,34 180 top
R9  19.6,32.4 0 top
R10  13.9,27.76 180 top
R11  11.08,27.78 0 top
R14  34.75,10.04 0 top
R32  22.45,16.49 270 top
RN1  3.7,12.6 0 top
T2  12.51,25.72 0 top
U1  9.4,9.9 90 top
U4  23.61,18.85 270 top
U5  30.7,29.1 270 top
U29  23.69,14.31 180 top
U$1  22.06,9.56 270 top
U$2  25.08,30.79 90 top
U$4  31.63,40.67 0 top

### Tracks (layer width: path | path; a pad name or v marks a point on that pad's centre or on a via)
BUSY  (via drill 0.2)
  Top 0.127: K2.9 5.28,26.23 v5.25,26.2 | v24.25,26.65 24.3,26.65 24.45,26.8 24.45,27.76 U$2.5
  Bottom 0.127: v5.25,26.2 6.39,27.34 7.99,27.34 8.23,27.1 9.1,27.1 15.65,33.65 20.36,33.65 21.3,32.72 21.3,32.65 21.54,32.41 21.54,29.78 23.02,28.3 23.85,28.3 24.25,27.9 v24.25,26.65
CS  (via drill 0.2)
  Top 0.127: U$2.41 21.68,31.39 21.48,31.59 20.75,31.59 20.32,31.15 18.47,31.15 18.3,31.32 v17.96,31.32 | v8.2,25.5 7.43,24.73 K2.12
  Bottom 0.127: v17.96,31.32 17.7,31.58 17.7,32 17.2,32.5 16.5,32.5 9.3,25.3 8.4,25.3 v8.2,25.5
DC  (via drill 0.2)
  Top 0.127: U$2.40 21.68,31.79 21.56,31.91 20.34,31.91 v20.1,31.67 | K2.11 6.59,25.36 7.2,25.36 8.09,26.26 v8.29,26.26
  Bottom 0.127: v20.1,31.67 19.83,31.67 18.42,33.08 16.08,33.08 9.42,26.42 8.79,26.42 8.62,26.26 v8.29,26.26
FRST  (via drill 0.2)
  Top 0.127: U$2.27 26.48,34.59 v26.49,34.61 | v32.4,28.95 32.5,28.85 U5.5
  Bottom 0.127: v26.49,34.61 26.51,34.61 27.84,33.28 28.27,33.28 28.43,33.45 30.1,33.45 31.24,32.31 31.24,30.2 32.4,29.04 v32.4,28.95
GDR
  Top 0.305: T2.3 13.47,26.76 R10.2 11.51,29.73 K2.2
GND  (via drill 0.2)
  Top 0.152: U29.6 23.14,14.42 23.51,14.42 23.69,14.24 23.69,13.84 23.75,13.78 23.75,13.75 23.94,13.56 U29.1
  Top 0.203: U$2.45 20.71,29.79 C11.2
  other vias: 31.45,38.95 29.95,38.95 28.6,38.95 27.2,38.95 26.2,38.35 26,37.3 26,36.25 26.05,35.35 24.5,35.6 24.5,36.6 23.5,37.35 24.45,38.1 24.75,39.2 25.55,40.1 26.85,40.5 28.2,40.5 29.55,40.5 30.8,40.5 12.45,19.9 30.05,36.6 28.45,35.6 30.4,35.2 25.5,18.5 25.5,17.8 30.85,42.4 30.9,41.4 24.8,17.8 24.8,18.5 29.15,41.9 23.4,40.3 33,32.9 12.1,20.95 21.7,24.05 25.95,24.15 28.1,27.25 28.05,37.2 11.5,23.7 24.9,41.45 14.55,25.65 10.45,25.05 27.6,41.6 21.65,38.5 23.1,39 19.5,35.6 16.9,34.95 14.9,23.8 16.05,25.5 15.3,26.85 16.8,26.8 15.35,28.75 19.8,25.6 20.1,23.55 17.5,11.3 31.45,34.9 31.45,37.6 32,34.2 33.35,34.2 34.7,34.2 37.15,34.9 37.15,36.15 37.15,37.45 37.15,38.8 37.15,40.2 37.5,41.2 28.65,13.95 26.4,12.45 20.95,17.45 25.05,11.65 17.4,15.05 37.5,42.4 29.55,19.35 30.65,29.15 31.4,27.55 31,24.85 28.15,25.35 38.5,36.65 38.25,39.45 31.45,36.2 20.65,37.35 35.65,15.05 35,19.2 23.05,20.5 26.65,21.05 28.95,20.95 29.3,15.3 17.4,12.9 18.6,17.4
  pour Top: 23.5,14.5 22.5,14.5 22.05,14.95 22.05,19.85 22.15,19.95 26.1,19.95 26.45,19.6 26.45,16.05 25.95,16.05 25.75,16.25 25.75,17.15 25.6,17.3 24.5,17.3 24.4,17.2 24.4,15.95 23.75,15.3 23.75,14.75
  pour Top: 23.9,11.05 23.9,13.6 24.95,13.6 25.2,13.35 26.1,13.35 26.8,14.05 26.8,15.75 26.3,16.25 25.95,16.25 25.95,19.95 38.95,19.95 38.95,8.9 26.05,8.9
  pour Top: 23.9,10.95 23.5,10.55 19.05,10.55 18.05,11.55 18.05,16.75 18.2,16.9 22.05,16.9 22.15,16.8 22.15,19.95 -0.1,19.95 -0.1,9.25 9.15,0 25,0 33.88,8.88 31.8,10.95
  pour Top: 39.05,19.8 39.05,34.5 31.7,34.5 31.7,43 0.05,43 0.05,19.8 0.1,19.75 39,19.75
  pour Top: 36.9,34.35 36.9,42.95 39.05,42.95 39.05,34.3 36.95,34.3
  pour Route2: 0.05,42.95 31.65,42.95 31.65,34.55 36.85,34.55 36.85,42.95 38.95,42.95 38.95,8.9 33.9,8.9 24.95,-0.05 0.05,-0.05
  pour Bottom: 0.1,43 31.7,43 31.7,34.55 36.9,34.55 36.9,43 39.2,43 39.2,-0.05 0.1,-0.05
INT  (via drill 0.2)
  Top 0.127: U$2.20 28.62,31.39 v28.86,31.15 | v11.7,12.6 9.35,12.6 9,12.25 9,10.85 U1.7
  Bottom 0.127: v28.86,31.15 28.73,31.15 27.73,30.16 27.73,28.9 27.16,28.32 26.44,28.32 24.77,26.65 24.77,26.43 23.69,25.36 23.69,24.94 20.1,21.35 19.43,21.35 11.7,13.62 v11.7,12.6
LED_B  (via drill 0.2)
  Top 0.127: U$2.17 28.12,30.23 29.66,30.23 v29.7,30.19 | RN1.6 4.08,13.23 4.08,13.44 4.21,13.57 4.79,13.57 4.93,13.42 11.99,13.42 12.13,13.57 12.56,13.57 12.78,13.35 v13.11,13.35
  Bottom 0.127: v29.7,30.19 29.66,30.23 28.6,30.23 28.29,29.93 28.29,28.66 27.39,27.76 26.78,27.76 25.42,26.4 25.42,26.27 24.25,25.11 24.25,24.6 20.4,20.75 19.75,20.75 13.11,14.11 v13.11,13.35
LED_G  (via drill 0.2)
  Top 0.127: U$2.18 28.12,30.63 29.08,30.63 29.39,30.95 v29.62,30.95 | v12.35,13.05 11.98,13.05 11.91,13.12 4.52,13.12 RN1.5
  Bottom 0.127: v29.62,30.95 29.18,30.51 28.48,30.51 28.01,30.04 28.01,28.78 27.27,28.04 26.55,28.04 25.14,26.62 25.14,26.39 23.97,25.22 23.97,24.77 20.25,21.05 19.53,21.05 12.35,13.87 v12.35,13.05
LED_R  (via drill 0.2)
  Top 0.127: U$2.16 28.78,29.79 v28.86,29.71 | RN1.7 3.58,13.23 3.58,13.44 3.99,13.84 4.91,13.84 5.05,13.7 11.87,13.7 12.04,13.87 13.61,13.87 v13.82,13.66
  Bottom 0.127: v28.86,29.71 28.77,29.62 28.77,28.75 27.5,27.48 26.9,27.48 25.7,26.28 25.7,26.16 24.55,25.01 24.55,24.5 20.5,20.45 19.9,20.45 13.82,14.37 v13.82,13.66
N$1
  Top 0.127: Q2.2 22.12,26.48 | 22.12,26.48 22.84,27.2 23,27.2 23.28,27.48 U$2.2 | C1.1 21.52,26.48 22.12,26.48
N$2
  Top 0.127: U$2.3 23.68,26.64 Q2.1 23.46,25.39 C2.1
N$3
  Top 0.127: U$2.35 23.28,34.12 23,34.4 22.1,34.4 21.59,34.91 Q1.3 21.39,35.41 C3.1
N$4
  Top 0.127: U$2.34 23.68,35.82 23.23,36.27 Q1.1 22.62,36.58 C4.1
N$5
  Top 0.203: U$2.47 19.36,28.99
  Top 0.254: 19.36,28.99 L2.2
N$6
  Top 0.203: 25.28,34.23 U$2.30
  Top 0.305: 25.28,34.23 C10.2 L1.1
N$7
  Top 0.203: C6.2 21.82,27.79 U$2.1
N$8
  Top 0.127: U4.14 27.61,17.85 R4.2
N$9
  Top 0.127: R5.2 27.26,16.24 26.88,16.62 U4.12
N$10
  Top 0.254: L2.1 17.68,29.01 L3.2
N$11
  Top 0.203: C11.1 19.58,30.02 20.21,29.39 U$2.46
  Top 0.254: C11.1 L3.1
N$12
  Top 0.127: U4.16 27.7,18.85 R6.2
N$14
  Top 0.305: D2.2 2.85,11.17 3.45,11.77 RN1.2
N$15
  Top 0.127: D3.2 35.19,10.03 R14.2
N$16  (via drill 0.2)
  Top 0.127: U4.9 24.31,16.65 v23.6,16.65 | R14.1 v33.26,10.04 v33.25,10.05
  Bottom 0.127: v33.25,10.05 30.75,10.05 24.15,16.65 v23.6,16.65
N$17
  Top 0.305: C18.1 13.29,21.71 | 13.29,21.71 13.29,22.6 | 13.29,22.6 13.29,22.9 L5.2 | D9.2 12.95,22.05 | 12.95,22.05 13.29,21.71 | D9.2 13.17,22.48 13.29,22.6 | L5.2 13.73,22.83 13.05,22.15 | 13.05,22.15 12.95,22.05 | D9.2 12.72,22.48 13.05,22.15 | D9.2 12.87,22.48 L5.2 | L5.2 12.54,24.54 T2.1 12.74,24.5 13.1,24.5 | 13.6,24.2 13.4,24.2 13.1,24.5 | L5.2 13.1,23.97 13.1,24.5
N$18
  Top 0.305: D8.2 11.57,17.17 11.07,17.67 | 11.5,18.47 11.52,18.47 | 11.52,18.47 C18.2 | 10.91,17.67 11.07,17.67 | D8.2 11.52,17.35 11.52,18.47 | 11.52,18.28 C18.2 | 11.07,17.67 11.25,17.85 | 11.25,17.85 11.52,18.12 11.52,18.28 | D8.2 11.25,17.62 11.25,17.85 | 11.52,18.28 11.19,18.28 10.95,18.05 D6.1 10.8,17.67 | C18.2 10.91,17.67 | 10.91,17.67 10.8,17.67 | D8.2 11.3,17.17 10.8,17.67 | D8.2 C18.2
N$20
  Top 0.305: D2.3 4.54,12.05 RN1.4
N$21
  Top 0.305: D2.4 4.26,9.95 3.77,10.44 3.77,11.34 3.95,11.52 RN1.3
N$26
  Top 0.305: C21.2 8.8,18.6 7.67,19.73 K2.22
N$27
  Top 0.305: K2.20 8.6,20.73 C22.2
N$28
  Top 0.305: K2.19 7.73,21.23 8.9,22.4 C23.2
N$29
  Top 0.305: C24.2 9.29,23.2 8.8,23.2 8.67,23.07 8.67,22.95 7.45,21.73 K2.18
N$36
  Top 0.305: K2.5 7.27,28.23 7.91,27.59 C27.2
N$37
  Top 0.305: K2.4 7.67,28.73 7.91,28.49 C26.2
N$80
  pour Top: 23.4,13.95 19.9,13.95 18.65,15.2 18.65,16.4 21.25,16.4 21.25,15.1 22.2,14.15 23.4,14.15
N$94
  Top 0.127: R32.2 22.45,15.3 22.69,15.06 U29.5
NRESET
  Top 0.127: U5.7 31.44,29.86 30.42,30.88 30.42,31.28 29.95,31.75 29.7,31.75 29.07,32.38 R1.1 28.98,32.99 U$2.24
PREVGH
  Top 0.305: K2.21 8.07,20.23 8.46,19.84 C20.2 10.58,20.75 11.05,20.75 11.42,21.12 D9.1
PREVGL
  Top 0.305: C17.2 9.47,16.79 D6.2 9.03,17.67 7.47,19.23 K2.23
RES  (via drill 0.2)
  Top 0.127: U$2.39 21.48,32.19 21.18,32.49 20.79,32.49 v20.78,32.5 | v7.78,26.82 7.78,26.48 7.77,26.47 7.77,26.37 7.13,25.73 K2.10
  Bottom 0.127: v20.78,32.5 19.39,32.5 18.53,33.36 15.86,33.36 9.3,26.8 7.8,26.8 v7.78,26.82
RESE
  Top 0.305: T2.2 11.51,26.8 R11.2 11.58,27.86 10.21,29.23 K2.3
RF
  Top 0.305: L1.2 25.25,36.58 C12.2 25.25,37.95 arc-94 27.2,39.75 32.9,39.75 arc98 33.55,40.5 U$4.P$2
RX  (via drill 0.2)
  Top 0.127: U5.4 34.69,28.34 v34.95,28.6 | U$2.10 26.48,27.24 26.83,26.89 26.83,26.17 v26.95,26.05
  Bottom 0.127: v26.95,26.05 34.2,26.05 35.57,27.42 35.57,28.18 35.15,28.6 v34.95,28.6
SCL  (via drill 0.2)
  Top 0.127: U$1.9 11.76,4.31 v11.73,4.33 | v10.4,8.4 9.7,9.1 U1.2 | v16.9,31.63 18.29,33.02 19.2,33.02 | U$2.38 21.48,32.59 21.05,33.02 19.2,33.02 | R9.1 19.18,32.99 19.2,33.02
  Bottom 0.127: v11.73,4.33 10.4,5.67 v10.4,8.4 10.4,13.35 18.7,21.65 18.7,26.3 16.2,28.8 16.2,30.9 16.9,31.6 v16.9,31.63
SCLK  (via drill 0.2)
  Top 0.127: v17.3,30.77 17.34,30.8 20.36,30.8 20.85,31.29 21.28,31.29 21.58,30.99 U$2.42 | v8.1,24.6 7.9,24.6 7.53,24.23 K2.13
  Bottom 0.127: v17.3,30.77 17.3,31.29 17.42,31.41 17.42,31.84 17.06,32.2 16.7,32.2 9.3,24.8 8.3,24.8 v8.1,24.6
SDA  (via drill 0.2)
  Top 0.127: U$1.10 13.74,3.06 v13.4,3.4 | v11.1,9.9 U1.4 | 19.2,33.4 21.17,33.4 21.58,32.99 U$2.37 | 19.2,33.4 17.84,33.4 16.3,31.86 16.3,30.5 v16.8,30 | 19.2,33.4 19.2,33.98 R8.1
  Bottom 0.127: v13.4,3.4 11.1,5.7 v11.1,9.9 11.1,13.45 19,21.35 19,26.4 16.8,28.6 v16.8,30
SDI  (via drill 0.2)
  Top 0.127: U$2.43 21.06,30.59 v21.02,30.62 | K2.14 7.53,23.73 7.88,24.08 8.31,24.08 8.72,24.48 8.72,25.62 v9,25.9
  Bottom 0.127: v21.02,30.62 20.41,30.62 19.58,31.45 19.58,31.52 18.3,32.8 16.3,32.8 9.4,25.9 v9,25.9
SWDCLK  (via drill 0.2)
  Top 0.127: U$2.25 v28.04,33.79 v28.05,33.8 | v31.76,30.41 31.8,30.38 33.56,30.38 U5.8
  Bottom 0.127: v31.76,30.41 31.75,30.43 31.75,32.2 30.14,33.8 v28.05,33.8
SWDIO  (via drill 0.2)
  Top 0.127: U5.9 32.4,30.85 v32.35,30.9 | U$2.26 26.86,33.81 26.86,34.09 27.28,34.5 v27.65,34.5
  Bottom 0.127: v32.35,30.9 32.35,31.99 29.84,34.5 v27.65,34.5
SWO
  Top 0.127: U5.6 32.73,29.35 32.62,29.47 31.43,29.47 30.14,30.76 30.14,31.16 29.83,31.47 29.58,31.47 29.26,31.79 U$2.21
TS
  Top 0.127: R7.2 27.57,19.57 U4.1
TX  (via drill 0.2)
  Top 0.127: U5.3 34.9,27.86 v35.05,27.7 | U$2.8 25.68,27.29 26,26.97 26,26.1 v26.2,25.9
  Bottom 0.127: v35.05,27.7 33.95,26.6 26.7,26.6 26.2,26.1 v26.2,25.9
VBUS
  Top 0.305: J4.B9 31.7,15.7 31.45,15.45 J4.A4 30.58,15.45 30.36,15.67 30.36,16.84 30.25,16.95 | J4.B4 31.7,18.2 31.45,18.45 J4.A9 30.58,18.45 30.36,18.23 30.36,17.05 30.25,16.95 | 30.25,16.95 30.2,16.9 29.54,16.9 C7.1 27.45,16.95 27.05,17.35 U4.13
VCOM
  Top 0.305: K2.24 7.32,18.73 8.9,17.15 8.9,16.42 9.47,15.85 C16.2
VDD  (via drill 0.2, 0.3, 0.35)
  Top 0.127: R9.2 19.69,32.07 19.69,32.04 19.48,31.83 v18.53,31.83 | R8.2 18.38,34.77 v18.4,34.8 | R1.2 30,33 v30,32.35
  Top 0.203: v20.57,28.33 20.84,28.59 U$2.48
  Top 0.254: C14.2 28.86,28.3 28.58,28.59 U$2.13 | U$2.36 22.65,34.02 22.2,34.02 | 22.2,34.02 C8.2 | C15.2 v20.57,28.33 | 22.2,34.02 v22.2,33.6
  Top 0.305: K2.16 K2.15 v7.99,23.23 8.97,24.22 C19.1 | U$1.7 13.36,6.81 C29.1 12.15,6.75 v12.1,6.8 | U$1.19 23.81,6.56 25.87,6.56 C58.1 25.97,6.56 26.86,6.56 v27.1,6.8 | v6.4,9.9 6.4,9.82 6.8,9.43 C28.2 7.62,9.4 U1.10 8.9,9.1 U1.1 | U1.6 9.65,11.65 v9.7,11.7 | D2.1 2.45,9.95 2,10.4 2,10.9 | 2,10.9 2,11.4 2.7,12.1 RN1.1 RN1.8 | 2,10.9 1.95,10.95 v1.95,11.45 | L5.1 16.73,24.04 C9.2 17.58,23.02 v17.6,23 | 29.6,28.3 29.96,28.3 C13.2 | 29.6,28.3 C14.2 | 29.6,28.3 v29.6,29.2 | U5.2 32.35,27.35 v32.3,27.4 | D3.1 38.18,10.03 v38.25,10.1
  other vias: 19.2,11.55 22.4,11.5 21.55,11.5 20.85,11.5 20.1,11.55 22.15,12.25 22.15,13
  pour Top: 18.6,13.6 22.5,13.6 22.55,13.65 23.4,13.65 23.4,12.75 23.45,12.7 23.45,11.4 23.15,11.1 19.2,11.1 18.45,11.85 18.45,13.45
  pour Route15: 0.1,43 31.7,43 31.7,34.6 36.9,34.6 36.9,43 39.15,43 39.15,0 0.1,0
VPROC  (via drill 0.2)
  Top 0.178: U4.5 22.7,18.85 v22.65,18.8 | v23.85,15.87 23.87,15.87 24.38,15.36 U29.4
  Bottom 0.178: v22.65,18.8 22.65,17.4 23,17.05 23,16.05 23.18,15.87 v23.85,15.87
  pour Top: 24.1,14 24.1,15.15 24.8,15.85 24.8,16.9 25.4,16.9 25.4,16.1 25.8,15.7 26.3,15.7 26.3,14.1 26,13.8 25.2,13.8 25,14